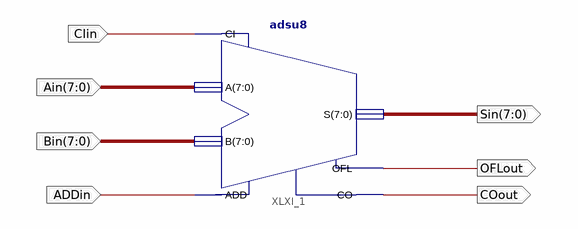
[diagram p0: schematic sheet 1]
// Xilinx ISE schematic ALU.sch (spartan3e) as structural Verilog: 1 symbols, 7 ports
module ALU (
  input  CIin,
  input  ADDin,
  input  [7:0] Ain,
  input  [7:0] Bin,
  output [7:0] Sin,
  output OFLout,
  output COout
);

  adsu8 XLXI_1 (.A(Ain), .ADD(ADDin), .B(Bin), .CI(CIin), .CO(COout), .OFL(OFLout), .S(Sin));
endmodule
